# EAGLE schematic stm32_tracker34 (EAGLE 8.6.3)
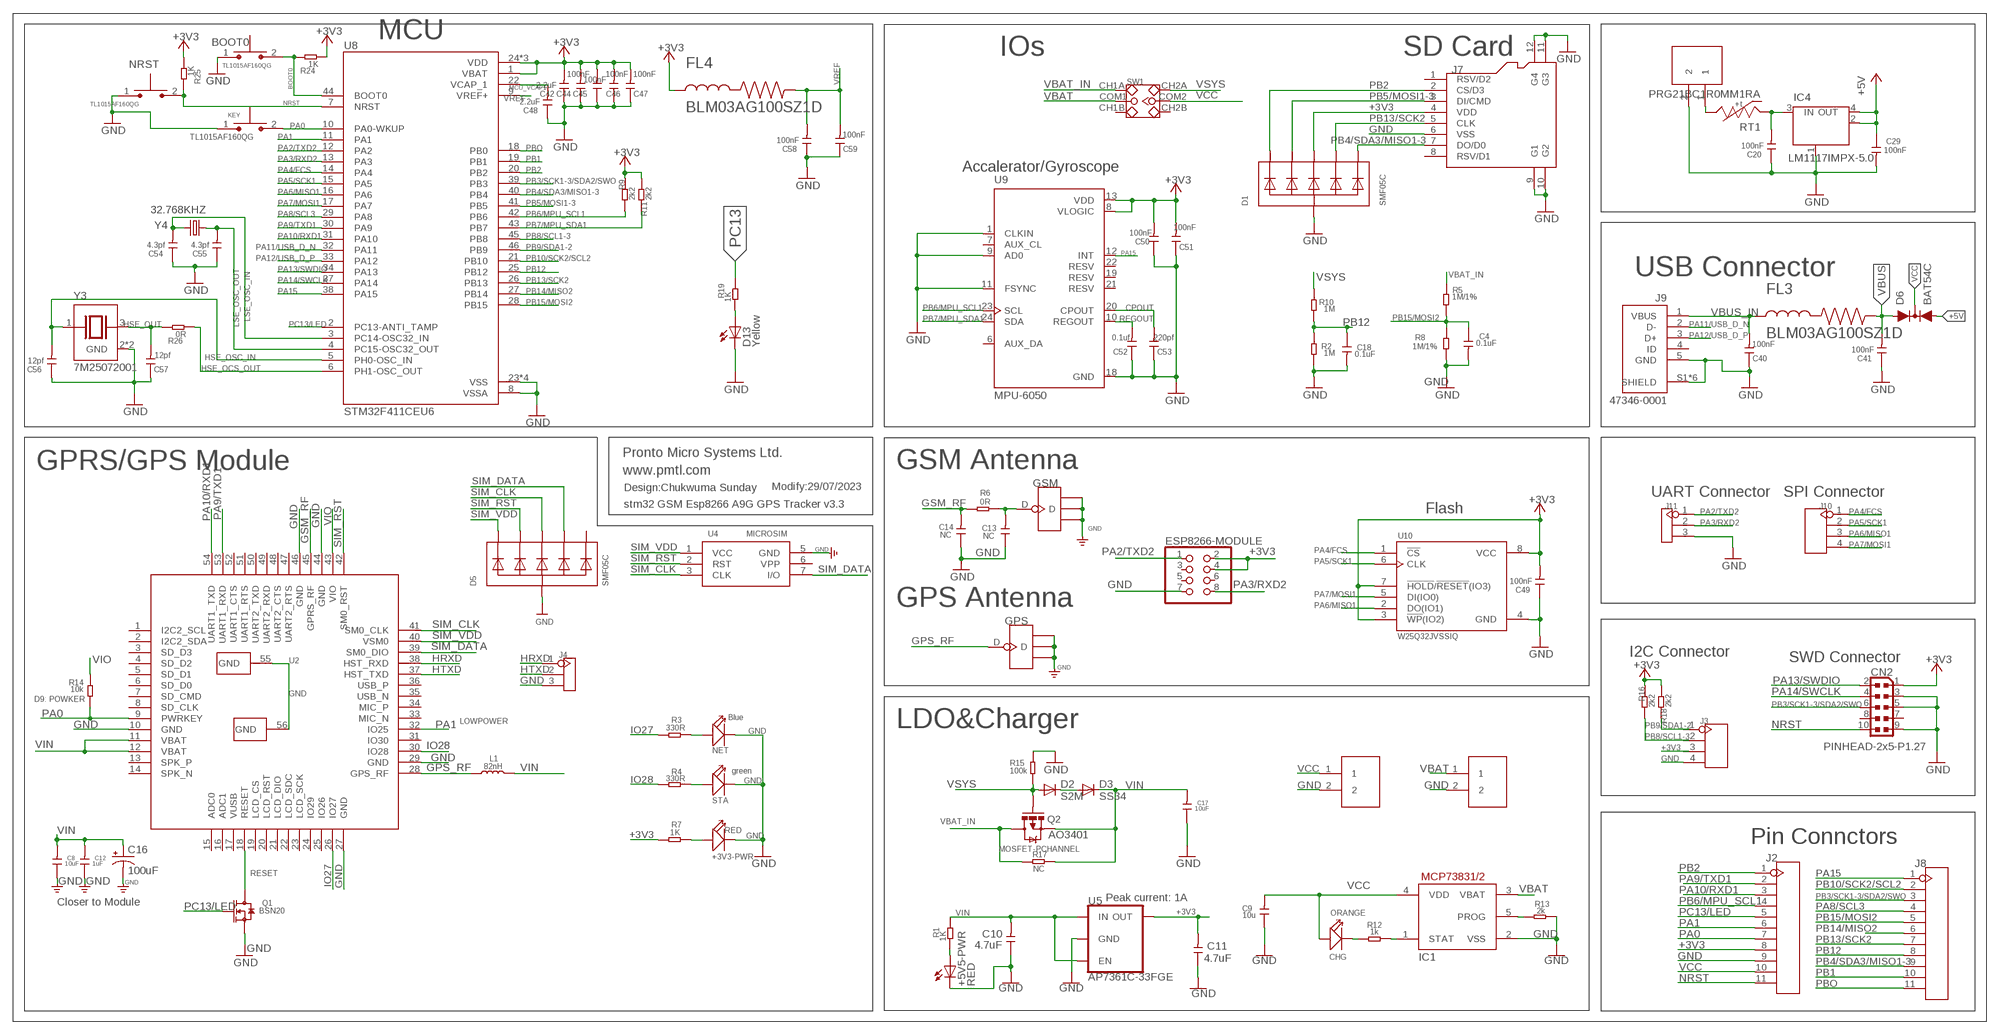
[diagram p0: schematic, sheet 1]

## Parts
+3V3-PWR  RED  LED'0603'  [LED-0603]
+5V5-PWR  RED  OPTO_0043_KPT-2012SGC  [OPTO_CHIPLED_0805]
BOOT0  TL1015AF160QG  [SW_TL1015AF160QG]
C4  0.1uF  C-0603  [C0603]
C8  10uF  C-0603  [C0603]
C9  10u  C-0603  [C0603]
C10  4.7uF  C-0603  [C0603]
C11  4.7uF  C-0603  [C0603]
C12  1uF  C-0603  [C0603]
C13  NC  C-0402  [C0402]
C14  NC  C-0402  [C0402]
C16  100uF  68UF-POLAR-EIA3528-10V-10%(TANT)  [EIA3528]
C17  10uF  C-0603  [C0603]
C18  0.1uF  C-0603  [C0603]
C20  100nF  C-0603  [C0603]
C29  100nF  C-0603  [C0603]
C40  100nF  C-0603  [C0603]
C41  100nF  C-0603  [C0603]
C42  2.2uF  C-0603  [C0603]
C44  100nF  C-0603  [C0603]
C45  100nF  C-0603  [C0603]
C46  100nF  C-0603  [C0603]
C47  100nF  C-0603  [C0603]
C48  2.2uF  C-0603  [C0603]
C49  100nF  C-0603  [C0603]
C50  100nF  C-0603  [C0603]
C51  100nF  C-0603  [C0603]
C52  0.1uf  C-0603  [C0603]
C53  220pf  C-0603  [C0603]
C54  4.3pf  C-0603  [C0603]
C55  4.3pf  C-0603  [C0603]
C56  12pf  C-0603  [C0603]
C57  12pf  C-0603  [C0603]
C58  100nF  C-0603  [C0603]
C59  100nF  C-0603  [C0603]
CHG  ORANGE  007-LED0603  [D0603]
CN2  PINHEAD-2x5-P1.27  0171_PH127-205DF055G00AROUND-PADS  [PINHEAD_2X05_127]
D1  SMF05C  TVSARRAY_5LANE  [SOT363]
D2  S2M  DIODE-DO-214AC  [DO-214AC]
D3  SS34  DIODE-DO-214AC  [DO-214AC]
D5  SMF05C  TVSARRAY_5LANE  [SOT363]
D6  BAT54C  [SOT23-R]
D13  Yellow  OPTO_0044_KPT-2012YC  [OPTO_CHIPLED_0805]
ESP8266-MODULE  PINHD-2X4  [2X04]
FL3  BLM03AG100SZ1D  [BEADC0603X33N]
FL4  BLM03AG100SZ1D  [BEADC0603X33N]
GPS  ANTENNA-U-FL  [4P-U-FL]
GSM  ANTENNA-U-FL  [4P-U-FL]
IC1  MCP73831/OT  [SOT23-5L]
IC4  LM1117IMPX-5.0  INTEGRATEDCIRCUITS_0022_LM1117IMPX-5.0  [INTEGRATEDCIRCUITS_LINEAR_SOT223]
J1  PH2.0-2P-90-DIP  [PH2.0-2P-90-DIP]
J2  HEADER-11P-2.54  [11P-2.54]
J3  HEADER-4P-60/35MILROUND  [4P-65/35ROUND]
J4  HEADER-3P-2.54  [3P-2.54]
J5  PH2.0-2P-90-DIP  [PH2.0-2P-90-DIP]
J6  PH2.0-2P-90-DIP  [PH2.0-2P-90-DIP]
J7  HOLDER-MICROSD-8P  [8P-SMD]
J8  HEADER-11P-2.54  [11P-2.54]
J9  47346-0001  [MOLEX_47346-0001]
J10  HEADER-4P-60/35MILROUND  [4P-65/35ROUND]
J11  HEADER-3P-2.54  [3P-2.54]
KEY  TL1015AF160QG  [SW_TL1015AF160QG]
L1  82nH  L'0603'  [L0603]
NET  Blue  LED'0603'  [LED-0603]
NRST  TL1015AF160QG  [SW_TL1015AF160QG]
Q1  BSN20  MOSFET-N'SOT23'  [SOT23@1]
Q2  MOSFET-PCHANNEL  [SOT23-3]
R1  1K  R-0603  [R0603]
R2  1M  R-0603  [R0603]
R3  330R  R-0603  [R0603]
R4  330R  R-0603  [R0603]
R5  1M/1%  R-0603  [R0603]
R6  0R  R-0603  [R0603]
R7  1K  R-0603  [R0603]
R8  1M/1%  R-0603  [R0603]
R9  2k2  R-0603  [R0603]
R10  1M  R-0603  [R0603]
R11  2k2  R-0603  [R0603]
R12  1k  R-0603  [R0603]
R13  2k  R-0603  [R0603]
R14  10k  R-0603  [R0603]
R15  100k  R-0603  [R0603]
R16  2k2  R-0603  [R0603]
R17  NC  R-0603  [R0603]
R18  2k2  R-0603  [R0603]
R19  1K  R-0603  [R0603]
R24  1K  R-0603  [R0603]
R25  1K  R-0603  [R0603]
R26  0R  R-0603  [R0603]
RT1  PRG21BC1R0MM1RA  [THRMC2012X110N]
STA  green  LED'0603'  [LED-0603]
SW1  SWITCH-2CH-6P  [6P-2CH-2.54-7.6X3.0]
U2  A9G  [A9G]
U4  MICROSIM  [MICROSIM]
U5  AP7361C-33FGE  [8-UDFN]
U8  STM32F411CEU6  [QFN50P700X700X60-49N]
U9  MPU-6050  [QFN50P400X400X95-24N]
U10  W25Q32JVSSIQ  [SOIC127P790X216-8N]
Y3  7M25072001  [XTAL_7M25072001]
Y4  32.768KHZ  9HT12-32.768KDZF-T  [XTAL160X100X50]

## Nets
+3V3: C11.2 C42.2 C44.2 C45.2 C46.2 C47.2 C49.2 C50.2 C51.2 CN2.1 D1.4(C3) ESP8266-MODULE.2 ESP8266-MODULE.4 FL4.1 J2.8 J3.3 J7.4(VDD) R7.1 R9.1 R11.1 R16.1 R18.1 R24.1 R25.1 U5.1(OUT) U8.1(VBAT) U8.24(VDD) U8.36(VDD) U8.48(VDD) U9.8(VLOGIC) U9.13(VDD) U10.3(!WP!(IO2)) U10.7(!HOLD!/!RESET!(IO3)) U10.8(VCC)
+5V: C29.1 D6.2(A2) IC4.2(OUT) IC4.4(OUT)
A9_RESET: Q1.3(D) U2.18(RESET)
BOOT0: BOOT0.2 R24.2 U8.44(BOOT0)
CPOUT: C53.2 U9.20(CPOUT)
GND: +3V3-PWR.- +5V5-PWR.C BOOT0.1 C4.2 C8.1 C9.1 C10.1 C11.1 C12.1 C13.1 C14.1 C16.C(-) C17.1 C18.2 C20.1 C29.2 C40.1 C41.1 C42.1 C44.1 C45.1 C46.1 C47.1 C48.1 C49.1 C50.1 C51.1 C52.1 C53.1 C54.1 C55.1 C56.1 C57.1 C58.1 C59.1 CN2.3 CN2.5 CN2.9 D1.2(A) D5.2(A) D13.C ESP8266-MODULE.7 GPS.GND1 GPS.GND2 GPS.GND3 GSM.GND1 GSM.GND2 GSM.GND3 IC1.2(VSS) IC4.1(GND/ADJ) J1.2 J2.9 J3.4 J4.3 J5.2 J6.2 J7.6(VSS) J7.9(G1) J7.10(G2) J7.11(G3) J7.12(G4) J9.5(GND) J9.S1(SHIELD) J9.S2(SHIELD) J9.S3(SHIELD) J9.S4(SHIELD) J9.S5(SHIELD) J9.S6(SHIELD) J11.3 KEY.1 NET.- NRST.1 Q1.2(S) R2.1 R8.1 R13.2 R15.2 STA.- U2.10(GND) U2.27(GND) U2.29(GND) U2.44(GND) U2.46(GND) U2.55(GND) U2.56(GND) U4.5(GND) U5.4(GND) U5.EP(GND) U8.8(VSSA) U8.23(VSS) U8.35(VSS) U8.47(VSS) U8.49(VSS) U9.1(CLKIN) U9.9(AD0) U9.11(FSYNC) U9.18(GND) U10.4(GND) Y3.2(GND) Y3.4(GND)
GPS_RF: GPS.D L1.1 U2.28(GPS_RF)
GSM_RF: C14.2 R6.1 U2.45(GPRS_RF)
HRXD: J4.1 U2.38(HST_RXD)
HSE_OCS_OUT: R26.1 U8.6(PH1-OSC_OUT)
HSE_OSC_IN: C56.2 U8.5(PH0-OSC_IN) Y3.1
HSE_OUT: C57.2 R26.2 Y3.3
HTXD: J4.2 U2.37(HST_TXD)
IO27: R3.1 U2.26(IO27)
IO28: R4.1 U2.30(IO28)
LSE_OSC_IN: C54.2 U8.3(PC14-OSC32_IN) Y4.2
LSE_OSC_OUT: C55.2 U8.4(PC15-OSC32_OUT) Y4.1
MCU_VCAP1: C48.2 U8.22(VCAP_1)
N$1: R4.2 STA.+
N$2: D2.C D3.A
N$3: +3V3-PWR.+ R7.2
N$4: J5.1 RT1.2
N$5: +5V5-PWR.A R1.1
N$6: C20.2 IC4.3(IN) RT1.1
N$7: NET.+ R3.2
N$16: D13.A R19.1
N$25: CHG.- R12.1
N$26: IC1.1(STAT) R12.2
N$31: IC1.5(PROG) R13.1
N$94: C13.2 GSM.D R6.2
NRST: CN2.10 J2.11 NRST.2 R25.2 U8.7(NRST)
PA0: J2.7 KEY.2 R14.1 U2.9(PWRKEY) U8.10(PA0-WKUP)
PA1: J2.6 U2.32(IO25) U8.11(PA1)
PA2/TXD2: ESP8266-MODULE.1 J11.1 U8.12(PA2)
PA3/RXD2: ESP8266-MODULE.8 J11.2 U8.13(PA3)
PA4/FCS: J10.1 U8.14(PA4) U10.1(!CS)
PA5/SCK1: J10.2 U8.15(PA5) U10.6(CLK)
PA6/MISO1: J10.3 U8.16(PA6) U10.2(DO(IO1))
PA7/MOSI1: J10.4 U8.17(PA7) U10.5(DI(IO0))
PA8/SCL3: J8.4 U8.29(PA8)
PA9/TXD1: J2.2 U2.53(UART1_RXD) U8.30(PA9)
PA10/RXD1: J2.3 U2.54(UART1_TXD) U8.31(PA10)
PA11/USB_D_N: J9.2(D-) U8.32(PA11)
PA12/USB_D_P: J9.3(D+) U8.33(PA12)
PA13/SWDIO: CN2.2 U8.34(PA13)
PA14/SWCLK: CN2.4 U8.37(PA14)
PA15: J8.1 U8.38(PA15) U9.12(INT)
PB1: J8.10 U8.19(PB1)
PB2: D1.1(C1) J2.1 J7.2(CS/D3) U8.20(PB2)
PB3/SCK1-3/SDA2/SWO: CN2.6 J8.3 U8.39(PB3)
PB4/SDA3/MISO1-3: D1.6(C5) J7.7(DO/D0) J8.9 U8.40(PB4)
PB5/MOSI1-3: D1.3(C2) J7.3(DI/CMD) U8.41(PB5)
PB6/MPU_SCL1: J2.4 R9.2 U8.42(PB6) U9.23(SCL)
PB7/MPU_SDA1: R11.2 U8.43(PB7) U9.24(SDA)
PB8/SCL1-3: J3.2 R16.2 U8.45(PB8)
PB9/SDA1-2: J3.1 R18.2 U8.46(PB9)
PB10/SCK2/SCL2: J8.2 U8.21(PB10)
PB12: C18.1 J8.8 R2.2 R10.1 U8.25(PB12)
PB13/SCK2: D1.5(C4) J7.5(CLK) J8.7 U8.26(PB13)
PB14/MISO2: J8.6 U8.27(PB14)
PB15/MOSI2: C4.1 J8.5 R5.1 R8.2 U8.28(PB15)
PBO: J8.11 U8.18(PB0)
PC13: R19.2
PC13/LED: J2.5 Q1.1(G) U8.2(PC13-ANTI_TAMP)
REGOUT: C52.2 U9.10(REGOUT)
SIM_CLK: D5.4(C3) U2.41(SM0_CLK) U4.3(CLK)
SIM_DATA: D5.5(C4) U2.39(SM0_DIO) U4.7(I/O)
SIM_RST: D5.3(C2) U2.42(SM0_RST) U4.2(RST)
SIM_VDD: D5.1(C1) U2.40(VSM0) U4.1(VCC)
VBAT: IC1.3(VBAT) J6.1 SW1.COM1
VBAT_IN: Q2.3(D) R5.2 R17.1 SW1.CH1A
VBUS: C41.2 D6.1(A1) FL3.2
VBUS_IN: C40.2 FL3.1 J9.1(VBUS)
VCC: C9.2 CHG.+ D6.3(C) IC1.4(VDD) J1.1 J2.10 SW1.COM2
VIN: C8.2 C10.2 C12.2 C16.A(+) C17.2 D3.C L1.2 Q2.2(S) R1.2 R17.2 U2.11(VBAT) U2.12(VBAT) U5.5(EN) U5.8(IN)
VIO: R14.2 U2.43(VIO)
VREF: C58.2 C59.2 FL4.2 U8.9(VREF+)
VSYS: D2.A Q2.1(G) R10.2 R15.1 SW1.CH2A
Unconnected: CN2.7 CN2.8 D5.6(C5) ESP8266-MODULE.3 ESP8266-MODULE.5 ESP8266-MODULE.6 J7.1(RSV/D2) J7.8(RSV/D1) J9.4(ID) SW1.CH1B SW1.CH2B U2.1(I2C2_SCL) U2.2(I2C2_SDA) U2.3(SD_D3) U2.4(SD_D2) U2.5(SD_D1) U2.6(SD_D0) U2.7(SD_CMD) U2.8(SD_CLK) U2.13(SPK_P) U2.14(SPK_N) U2.15(ADC0) U2.16(ADC1) U2.17(VUSB) U2.19(LCD_CS) U2.20(LCD_RST) U2.21(LCD_DIO) U2.22(LCD_SDC) U2.23(LCD_SCK) U2.24(IO29) U2.25(IO26) U2.31(IO30) U2.33(MIC_N) U2.34(MIC_P) U2.35(USB_N) U2.36(USB_P) U2.47(UART2_RTS) U2.48(UART2_CTS) U2.49(UART2_RXD) U2.50(UART2_TXD) U2.51(UART1_RTS) U2.52(UART1_CTS) U4.6(VPP) U9.6(AUX_DA) U9.7(AUX_CL) U9.19(RESV) U9.21(RESV) U9.22(RESV)

## Notes on the sheet
- MCU
- IOs | SD Card
- Accalerator/Gyroscope
- USB Connector
- Pronto Micro Systems Ltd.
- GPRS/GPS Module | GSM Antenna
- www.pmtl.com
- Design:Chukwuma Sunday | Modify:29/07/2023
- UART Connector | SPI Connector
- stm32 GSM Esp8266 A9G GPS Tracker v3.3
- Flash
- GPS Antenna
- I2C Connector
- SWD Connector
- D9: POWKER
- LOWPOWER
- LDO&Charger
- AO3401
- Pin Connctors
- RESET
- Peak current: 1A
- Closer to Module

## Library data of the parts
+3V3-PWR NET STA = Discrete:LED*
+5V5-PWR = SUNIOANO_SCHEMATIC22:OPTO_0043_KPT-2012SGC: LED GREEN - SMD-0805; MONTHLY_USAGE: _____; PART_NUMBER: KPT-2012SGC; PRICE: _____; SUPPLIER: _____; TYPE: Opto; VALUE: Green
BOOT0 KEY NRST = botton(TL1015AF160QG):TL1015AF160QG: Tactile Switch SPST-NO Top Actuated Surface Mount Check availability <https://pricing.snapeda.com/parts/TL1015AF160QG/E-Switch/view-part?ref=eda>; AVAILABILITY: In Stock; DESCRIPTION: Tactile Switch SPST-NO Top Actuated Surface Mount; MF: E-Switch; MP: TL1015AF160QG; PACKAGE: None; PRICE: None; PURCHASE-URL: https://pricing.snapeda.com/search?q=TL1015AF160QG&ref=eda
C4 C8-C14 C17 C18 C20 C29 C40-C42 C44-C59 = Discrete:C*: Ceramic Capacitors
C16 = SparkFun-Capacitors:68UF-POLAR: 68µF polarized capacitors A capacitor is a passive two-terminal electrical component used to store electrical energy temporarily in an electric field.; PROD_ID: CAP-10790; VALUE: 68uF
CHG = Discrete:007-LED*
CN2 = Connettori:0171_PH127-205DF055G00A: 2x5 PASSO 1,27
D1 D5 = microbuilder:TVSARRAY_5LANE: Voltage Transient Suppressor Array SOT363 SMF05C - 100W 5V: Digikey - SMF05CT1GOSCT-ND
D2 D3 = diode:DIODE-: DIODE
D6 = BAT54C:BAT54C: BAT54C Schottky Diodes (Common Cathode) 30V 200mA, SOT-23 Package Digikey: BAT54CFSCT-ND Check availability <https://pricing.snapeda.com/parts/BAT54C/Diotec%20Semiconductor/view-part?ref=eda>; AVAILABILITY: In Stock; DESCRIPTION: Diode Array 1 Pair Common Cathode Schottky 30 V 200mA Surface Mount TO-236-3, SC-59, SOT-23-3; MF: Diotec Semiconductor; MP: BAT54C; PACKAGE: SOT-23-3 Diotec; PRICE: None
D13 = SUNIOANO_SCHEMATIC22:OPTO_0044_KPT-2012YC: LED YELLOW - SMD - 0805; MONTHLY_USAGE: _____; PART_NUMBER: KPT-2012YC; PRICE: _____; SUPPLIER: _____; TYPE: Opto
ESP8266-MODULE = pinhead:PINHD-2X4: PIN HEADER
FL3 FL4 = FB0603(BLM03AG100SZ1D):BLM03AG100SZ1D: Check availability <https://pricing.snapeda.com/parts/BLM03AG100SZ1D/Murata/view-part?ref=eda>; AVAILABILITY: In Stock; DESCRIPTION: Ferrite Bead; MF: Murata; MP: BLM03AG100SZ1D; PACKAGE: 0603 Murata; PRICE: None; PURCHASE-URL: https://pricing.snapeda.com/search?q=BLM03AG100SZ1D&ref=eda
GPS GSM = Connector:ANTENNA-U-FL
IC1 = adafruit:MCP73831: MCP73831/2 Miniature Single-Cell, Fully Integrated Li-Ion, Li-Polymer Charge Management Controllers. Nice and small simple lipoly charge controller, with adjustable current and status output (LED) http://www.ladyada.net/library/pcb/eaglelibrary.html
IC4 = SUNIOANO_SCHEMATIC22:INTEGRATEDCIRCUITS_0022_LM1117IMPX-5.0: Low-dropout linear regulator 5V -LM1117IMPX-5.0; CASE: SOT223; MONTHLY_USAGE: _____; PART_NUMBER: LM1117IMPX-5.0; PRICE: _____; SUPPLIER: _____; TYPE: Circuito_Integrato
J1 J5 J6 = Connector:PH2.0-2P-90-DIP
J2 J8 = Connector:HEADER-11P
J3 J10 = Connector:HEADER-4P
J4 J11 = Connector:HEADER-3P
J7 = Connector:HOLDER-MICROSD-8P
J9 = usb2.0(47346-0001):47346-0001: USB Connectors MICRO USB B RECPT BTTM MOUNT ASSY Check availability <https://pricing.snapeda.com/parts/47346-0001/Molex/view-part?ref=eda>; AVAILABILITY: In Stock; DESCRIPTION: USB - micro B USB 2.0 Receptacle Connector 5 Position Surface Mount, Right Angle; MF: Molex; MP: 47346-0001; PACKAGE: None; PRICE: None
L1 = Discrete:L*
Q1 = Discrete:MOSFET-N: IRLL014: http://www.vishay.com/docs/91319/sihll014.pdf
Q2 = User-Submitted:MOSFET-PCHANNEL: Generic PMOSFET IRLML2244 - TRANS-11153 (SOT-23 -20V -4.3A) (1.Gate 2.Source 3.Drain) FQP27P06 - COM-10349 <http://www.sparkfun.com/products/10349> (TO-220 -60V -27A) (1.Gate 2.Source 3.Drain); PROD_ID: TRANS-08285
R1-R19 R24-R26 = Discrete:R*
RT1 = fuse12V_330mA(PRG21BC1R0MM1RA):PRG21BC1R0MM1RA: Check availability <https://pricing.snapeda.com/parts/PRG21BC1R0MM1RA/Murata/view-part?ref=eda>; AVAILABILITY: In Stock; DESCRIPTION: Ceramic PTC Resettable Fuse 12V 330 mA Ih Surface Mount 0805 (2012 Metric); MF: Murata; MP: PRG21BC1R0MM1RA; PACKAGE: 2012 Murata; PRICE: None; PURCHASE-URL: https://pricing.snapeda.com/search?q=PRG21BC1R0MM1RA&ref=eda
SW1 = Discrete:SWITCH-2CH-6P
U2 = A9G:A9G
U4 = Connector:MICROSIM
U5 = ublox:AP7361C-33FGE: AP7361C 3.3V LDO Regulator; PROD_ID: VREG-14094
U8 = STM32F411CEU6.:STM32F411CEU6: High-performance access line, ARM Cortex-M4 core with DSP and FPU, 512 Kbytes Flash, 100 MHz CPU, ART Accelerator Check availability <https://pricing.snapeda.com/parts/STM32F411CEU6/STMicroelectronics/view-part?ref=eda>; AVAILABILITY: In Stock; DESCRIPTION: ARM® Cortex®-M4 STM32F4 Microcontroller IC 32-Bit Single-Core 100MHz 512KB (512K x 8) FLASH 48-UFQFPN (7x7); MF: STMicroelectronics; MP: STM32F411CEU6; PACKAGE: UFQFN-48 STMicroelectronics; PRICE: None; PURCHASE-URL: https://pricing.snapeda.com/search/part/STM32F411CEU6/?ref=eda
U9 = MPU-6050:MPU-6050: MPU-6050 Six-Axis (Gyro + Accelerometer) MEMS MotionTracking™ Devices Check availability <https://pricing.snapeda.com/parts/MPU-6050/TDK%20InvenSense/view-part?ref=eda>; AVAILABILITY: In Stock; DESCRIPTION: MPU-6050 series Accelerometer, Gyroscope, 3 Axis Sensor Evaluation Board; MF: TDK InvenSense; MP: MPU-6050; PACKAGE: QFN-24 InvenSense; PRICE: None; PURCHASE-URL: https://pricing.snapeda.com/search?q=MPU-6050&ref=eda
U10 = W25Q32JVSSIQ:W25Q32JVSSIQ: NOR Flash Serial-SPI 3V/3.3V 32M-bit 4M x 8 8.5ns 8-Pin SOIC Check availability <https://pricing.snapeda.com/parts/W25Q32JVSSIQ/Winbond/view-part?ref=eda>; AVAILABILITY: In Stock; DESCRIPTION: FLASH - NOR Memory IC 32Mb (4M x 8) SPI - Quad I/O 133 MHz 8-SOIC; MF: Winbond; MP: W25Q32JVSSIQ; PACKAGE: SOIC-8 Winbond; PRICE: None; PURCHASE-URL: https://pricing.snapeda.com/search?q=W25Q32JVSSIQ&ref=eda
Y3 = 25mhz 9pf(7M25072001):7M25072001: Check availability <https://pricing.snapeda.com/parts/7M25072001/TXC/view-part?ref=eda>; AVAILABILITY: In Stock; DESCRIPTION: 25 MHz ±7ppm Crystal 9pF 4-SMD, No Lead; MF: TXC; MP: 7M25072001; PACKAGE: NON STANDARD-4 TXC; PRICE: None; PURCHASE-URL: https://pricing.snapeda.com/search?q=7M25072001&ref=eda
Y4 = 32.768khz(9HT12-32.768KDZF-T):9HT12-32.768KDZF-T: Crystal 32.7680khz 9pf Smd Check availability <https://pricing.snapeda.com/parts/9HT12-32.768KDZF-T/TXC/view-part?ref=eda>; AVAILABILITY: In Stock; DESCRIPTION: 32.768 kHz ±20ppm Crystal 12.5pF 90 kOhms 2-SMD, No Lead; MF: TXC; MP: 9HT12-32.768KDZF-T; PACKAGE: SMD-2 TXC; PRICE: None; PURCHASE-URL: https://pricing.snapeda.com/search?q=9HT12-32.768KDZF-T&ref=eda

## Net classes
0 default: width 0.203 mm, drill 0.305 mm, clearance 0.152 mm
2 gnd: width 0.305 mm, drill 0.559 mm, clearance 0.254 mm
3 usbvcc: width 0.508 mm, drill 0.61 mm, clearance 0.254 mm
4 USBpair: width 0.254 mm, drill 0.406 mm, clearance 0.406 mm